# EAGLE design FidoBark (EAGLE 7.2.0)
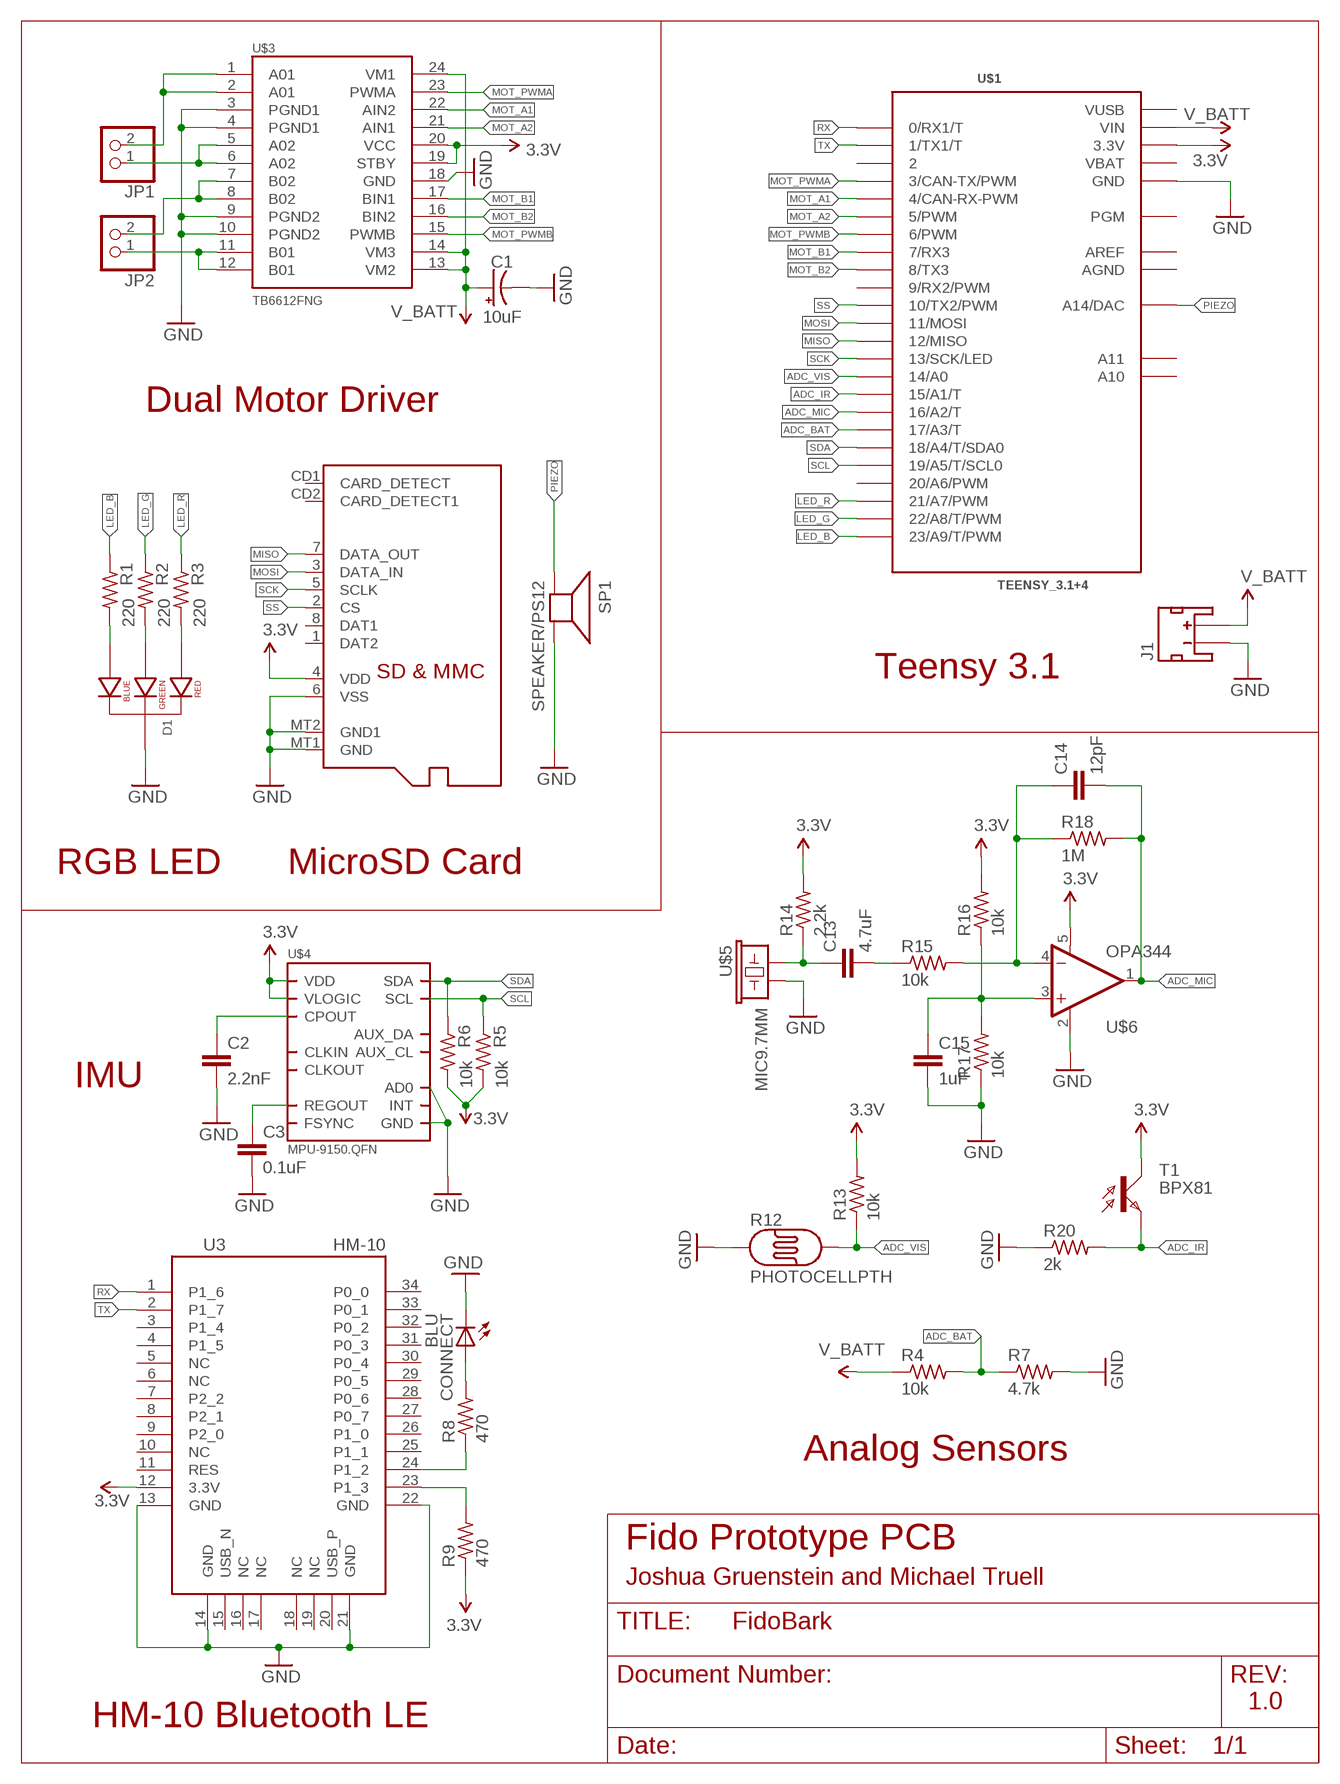
[diagram p0: schematic, sheet 1]

## Parts
C1  10uF  CAP_POL1206  [EIA3216]
C2  2.2nF  C-EUC0603  [C0603]
C3  0.1uF  C-EUC0603  [C0603]
C13  4.7uF  CAP0603-CAP  [0603-CAP]
C14  12pF  CAP0603-CAP  [0603-CAP]
C15  1uF  CAP0603-CAP  [0603-CAP]
CONNECT  BLU  LEDCHIPLED_0805  [CHIPLED_0805]
D1  LED-RGB-CC-THRUCLEAR  [LED-RGB-THRU]
J1  JST_2MM_MALE  [JST-2-SMD]
JP1  PINHD-1X2  [1X02]
JP2  PINHD-1X2  [1X02]
R1  220  R-US_R0603  [R0603]
R2  220  R-US_R0603  [R0603]
R3  220  R-US_R0603  [R0603]
R4  10k  R-US_R0603  [R0603]
R5  10k  R-US_R0603  [R0603]
R6  10k  R-US_R0603  [R0603]
R7  4.7k  R-US_R0603  [R0603]
R8  470  R-US_R0603  [R0603]
R9  470  R-US_R0603  [R0603]
R12  PHOTOCELLPTH  [PHOTOCELL]
R13  10k  R-US_R0603  [R0603]
R14  2.2k  R-US_R0603  [R0603]
R15  10k  R-US_R0603  [R0603]
R16  10k  R-US_R0603  [R0603]
R17  10k  R-US_R0603  [R0603]
R18  1M  R-US_R0603  [R0603]
R20  2k  R-US_R0603  [R0603]
SP1  SPEAKER/PS12  [PS12]
T1  BPX81  [BPX81]
U3  HM-10  [HM-10]
U$1  TEENSY_3.1+4  [TEENSY_3.1+4]
U$2  MICROSD  [MICROSD]
U$3  TB6612FNG  [SSOP24]
U$4  MPU-9150.QFN  [QFN.24.4X4]
U$5  MIC9.7MM  [MIC-9.7MM]
U$6  OPA344  [SOT23-5]

## Nets
3.3V: R5.2 R6.2 R9.1 R13.2 R14.2 R16.2 T1.C U3.12(3.3V) U$1.3.3V U$1.3.3V1(3.3V) U$2.4(VDD) U$3.19(STBY) U$3.20(VCC) U$4.3(VDD) U$4.8(VLOGIC) U$4.13(VDD) U$6.5(V+)
ADC_BAT: R4.2 R7.1 U$1.17/A3(17/A3/T)
ADC_IR: R20.2 T1.E U$1.15/A1(15/A1/T)
ADC_MIC: C14.2 R18.2 U$1.16/A2(16/A2/T) U$6.1(OUT)
ADC_VIS: R12.2 R13.1 U$1.14/A0
GND: C1.C(-) C2.2 C3.2 C15.2 CONNECT.C D1.2(CATHODE) J1.1(-) R7.2 R12.1 R17.1 R20.1 SP1.P$2(-) U3.13(GND) U3.14(GND) U3.21(GND) U3.22(GND) U$1.GND U$1.GND1(GND) U$2.6(VSS) U$2.MT1(GND) U$2.MT2(GND1) U$3.3(PGND1) U$3.4(PGND1) U$3.9(PGND2) U$3.10(PGND2) U$3.18(GND) U$4.9(AD0) U$4.15(GND) U$4.17(GND) U$4.18(GND) U$5.2 U$6.2(V-)
LED_B: R1.1 U$1.23/A9(23/A9/T/PWM)
LED_G: R2.1 U$1.22/A8(22/A8/T/PWM)
LED_R: R3.1 U$1.21/A7(21/A7/PWM)
MISO: U$1.12(12/MISO) U$2.7(DATA_OUT)
MOSI: U$1.11(11/MOSI) U$2.3(DATA_IN)
MOT_A1: U$1.4(4/CAN-RX-PWM) U$3.22(AIN2)
MOT_A2: U$1.5(5/PWM) U$3.21(AIN1)
MOT_B1: U$1.7(7/RX3) U$3.17(BIN1)
MOT_B2: U$1.8(8/TX3) U$3.16(BIN2)
MOT_PWMA: U$1.3(3/CAN-TX/PWM) U$3.23(PWMA)
MOT_PWMB: U$1.6(6/PWM) U$3.15(PWMB)
N$1: JP1.2 U$3.1(A01) U$3.2(A01)
N$2: D1.4(BLUE_CATHODE) R1.2
N$3: JP1.1 U$3.5(A02) U$3.6(A02)
N$4: JP2.2 U$3.7(B02) U$3.8(B02)
N$5: JP2.1 U$3.11(B01) U$3.12(B01)
N$6: D1.3(GREEN_CATHODE) R2.2
N$7: D1.1(RED_CATHODE) R3.2
N$8: C3.1 U$4.10(REGOUT)
N$9: C2.1 U$4.20(CPOUT)
N$10: R8.1 U3.24(P1_2)
N$11: R9.2 U3.23(P1_3)
N$16: CONNECT.A R8.2
N$28: C13.1 R14.1 U$5.1
N$29: C13.2 R15.1
N$30: C14.1 R15.2 R18.1 U$6.4(-IN)
N$32: C15.1 R16.1 R17.2 U$6.3(+IN)
PIEZO: SP1.P$1(+) U$1.A14(A14/DAC)
RX: U3.1(P1_6) U$1.0(0/RX1/T)
SCK: U$1.13(13/SCK/LED) U$2.5(SCLK)
SCL: R5.1 U$1.19/A5(19/A5/T/SCL0) U$4.23(SCL)
SDA: R6.1 U$1.18/A4(18/A4/T/SDA0) U$4.24(SDA)
SS: U$1.10(10/TX2/PWM) U$2.2(CS)
TX: U3.2(P1_7) U$1.1(1/TX1/T)
V_BATT: C1.A(+) J1.2(+) R4.1 U$1.VIN U$3.13(VM2) U$3.14(VM3) U$3.24(VM1)
Unconnected: J1.NC1(PAD1) J1.NC2(PAD2) U3.3(P1_4) U3.4(P1_5) U3.5(NC) U3.6(NC) U3.7(P2_2) U3.8(P2_1) U3.9(P2_0) U3.10(NC) U3.11(RES) U3.15(USB_N) U3.16(NC) U3.17(NC) U3.18(NC) U3.19(NC) U3.20(USB_P) U3.25(P1_1) U3.26(P1_0) U3.27(P0_7) U3.28(P0_6) U3.29(P0_5) U3.30(P0_4) U3.31(P0_3) U3.32(P0_2) U3.33(P0_1) U3.34(P0_0) U$1.2 U$1.9(9/RX2/PWM) U$1.20/A6(20/A6/PWM) U$1.A10 U$1.A11 U$1.PGM U$2.1(DAT2) U$2.8(DAT1) U$2.CD1(CARD_DETECT) U$2.CD2(CARD_DETECT1) U$4.1(CLKIN) U$4.6(AUX_DA) U$4.7(AUX_CL) U$4.11(FSYNC) U$4.12(INT) U$4.22(CLKOUT)

## Notes on the sheet
- Dual Motor Driver
- Teensy 3.1
- RGB LED | MicroSD Card
- IMU
- Analog Sensors
- Fido Prototype PCB
- Joshua Gruenstein and Michael Truell
- 1.0
- HM-10 Bluetooth LE

## Power pins joined to a net without a drawn wire
AGND: U$1.AGND
AREF: U$1.AREF
VBAT: U$1.VBAT
VUSB: U$1.VUSB

## Library data of the parts
C1 = SparkFun-Capacitors:CAP_POL: Capacitor Polarized These are standard SMD and PTH capacitors. Normally 10uF, 47uF, and 100uF in electrolytic and tantalum varieties. Always verify the external diameter of the through hole cap, it varies with capacity, voltage, and manufacturer. The EIA devices should be standard.
C2 C3 = rcl:C-EU: CAPACITOR, European symbol
C13-C15 = SparkFun-Passives:CAP: Capacitor Standard 0603 ceramic capacitor, and 0.1" leaded capacitor.
CONNECT = adafruit:LED: LED OSRAM: - CHIPLED LG R971, LG N971, LY N971, LG Q971, LY Q971, LO R971, LY R971 LH N974, LH R974 LS Q976, LO Q976, LY Q976 LO Q996 - Hyper CHIPLED LW Q18S LB Q993, LB Q99A, LB R99A - SideLED LS A670, LO A670, LY A670, LG A670, LP A670 LB A673, LV A673, LT A673, LW A673 LH A674 LY A675 LS A676, LA A676, LO A676, LY A676, LW A676 LS A679, LY A679, LG A679 - Hyper Micro SIDELED® LS Y876, LA Y876, LO Y876, LY Y876 LT Y87S - SmartLED LW L88C, LW L88S LB L89C, LB L89S, LG L890 LS L89K, LO L89K, LY L89K LS L896, LA L896, LO L896, LY L896 - TOPLED LS T670, LO T670, LY T670, LG T670, LP T670 LSG T670, LSP T670, LSY T670, LOP T670, LYG T670 LG T671, LOG T671, LSG T671 LB T673, LV T673, LT T673, LW T673 LH T674 LS T676, LA T676, LO T676, LY T676, LB T676, LH T676, LSB T676, LW T676 LB T67C, LV T67C, LT T67C, LS T67K, LO T67K, LY T67K, LW E67C LS E67B, LA E67B, LO E67B, LY E67B, LB E67C, LV E67C, LT E67C LW T67C LS T679, LY T679, LG T679 LS T770, LO T770, LY T770, LG T770, LP T770 LB T773, LV T773, LT T773, LW T773 LH T774 LS E675, LA E675, LY E675, LS T675 LS T776, LA T776, LO T776, LY T776, LB T776 LHGB T686 LT T68C, LB T68C - Hyper Mini TOPLED® LB M676 - Mini TOPLED Santana® LG M470 LS M47K, LO M47K, LY M47K Source: http://www.osram.convergy.de/
D1 = SparkFun-LED:LED-RGB-CC-THRU: RGB Through-hole common cathode LED SparkFun Storefront: COM-00105 (Clear) COM-09264 (Diffuse); PROD_ID: DIO-08418
J1 = SparkFun-Connectors:JST_2MM_MALE: Mates to single-cell LiPo batteries. CONN-11443 Now with smashable polarity marks!; BTM_NEG: -; BTM_POS: +; PROD_ID: CONN-11443; TOP_NEG: -; TOP_POS: +
JP1 JP2 = pinhead:PINHD-1X2: PIN HEADER
R1-R7 = rcl:R-US_: RESISTOR, American symbol
R8 R9 R13-R18 R20 = adafruit:R-US_: RESISTOR, American symbol
R12 = SparkFun-Sensors:PHOTOCELL: CdS photoresistor. This is a low cost way to detect light levels. Resistance decreases with more incoming light. SparkFun SKU: SEN-09088
SP1 = adafruit:SPEAKER: SPEAKER Source: Buerklin Added PS12 (for part # PS1240 piezo) http://www.ladyada.net/library/pcb/eaglelibrary.html
T1 = opto-trans-siemens:BPX81: PHOTO TRANSISTOR; OC_FARNELL: unknown; OC_NEWARK: unknown
U3 = HM-10_BLE:HM-10
U$1 = Teensy_3_Series_Board_v1.0:TEENSY_3.1+4: Footprint for Teensy 3.1 board using all through-holes, i.e. the entire perimeter plus the 4 through-holes inboard (A10,A11,AREF, VUSB)
U$2 = adafruit:MICROSD: Micro-SD / Transflash card holder with SPI pinout For the 3M # 2908-05WB-MG and/or 4UCON #19656 push-push type
U$3 = SparkFun-PowerIC:TB6612FNG: Toshiba 1A dual motor driver IC-09363; PROD_ID: IC-09363
U$4 = invensense:MPU-9150
U$5 = SparkFun-Sensors:MIC: Omni-directional electret microphone. 9.7mm standard diameter.; PROD_ID: COMP-08856
U$6 = SparkFun-AnalogIC:OPA344: Single gate rail-to-rail output op-amp. Inputs extend 300mV past rails.

## Board
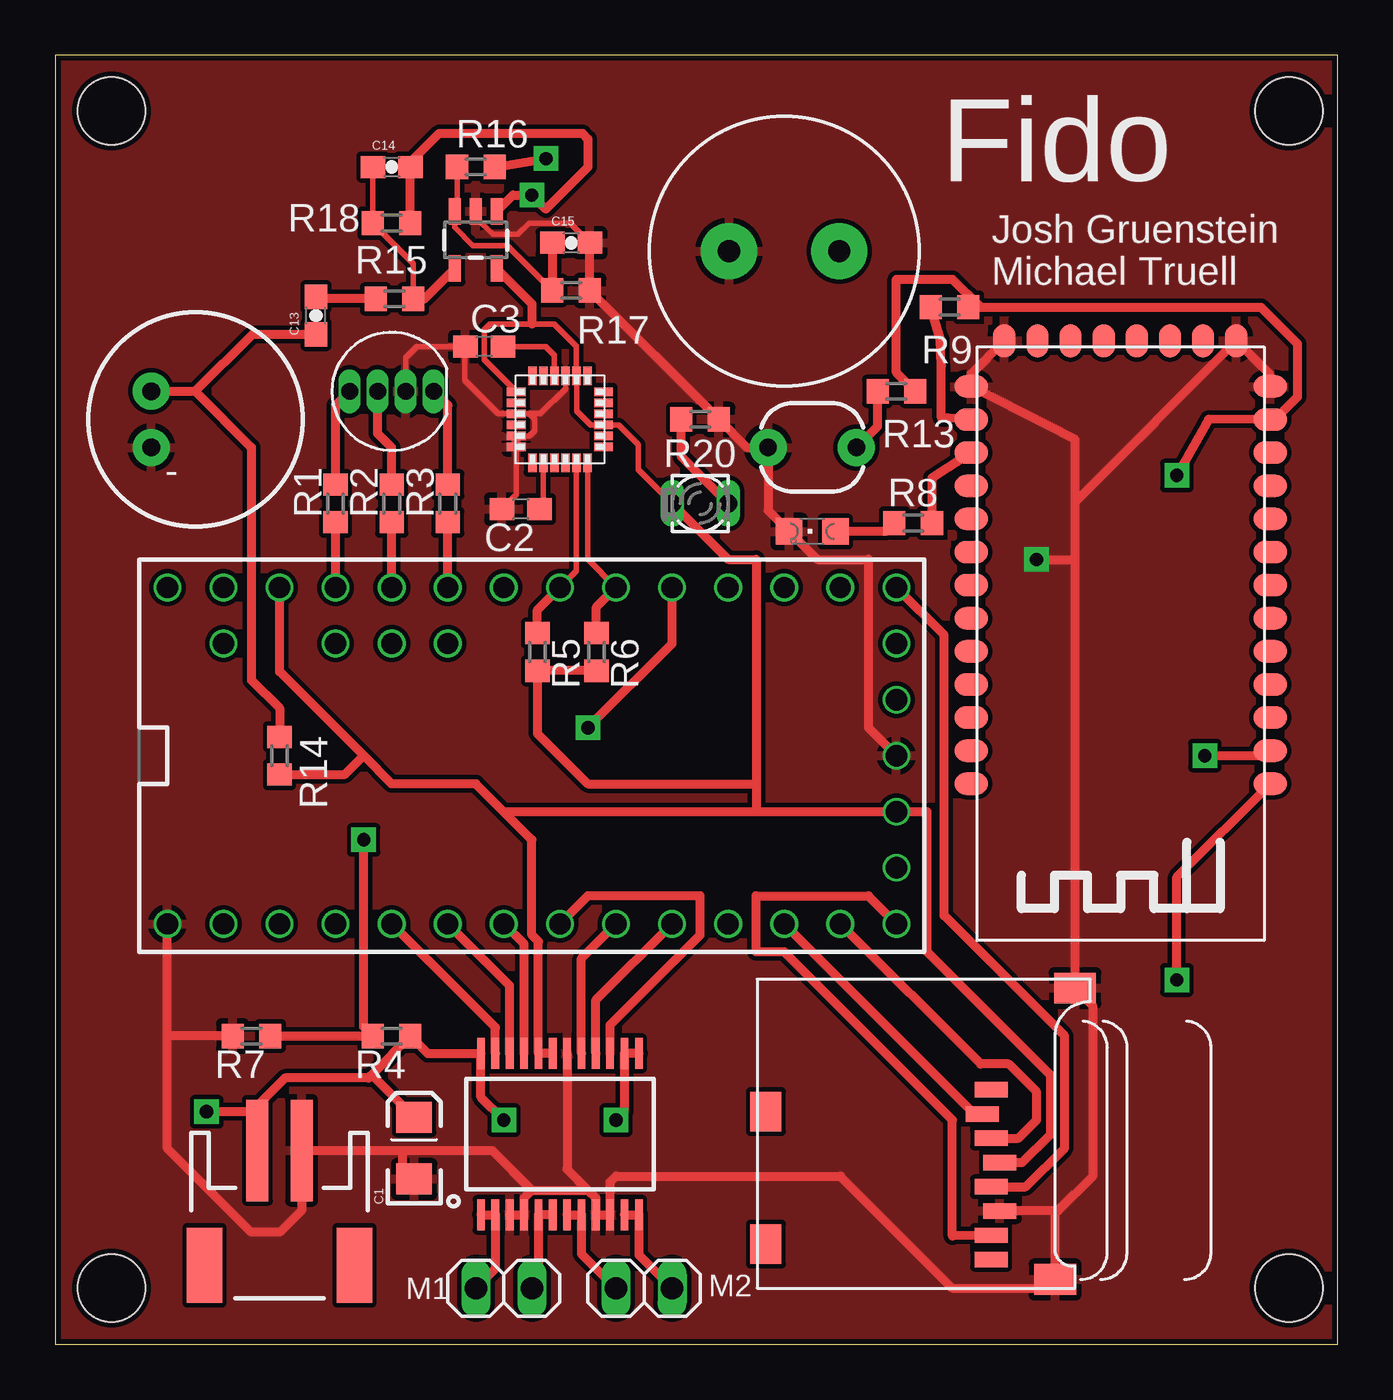
[diagram p1: board, top side]
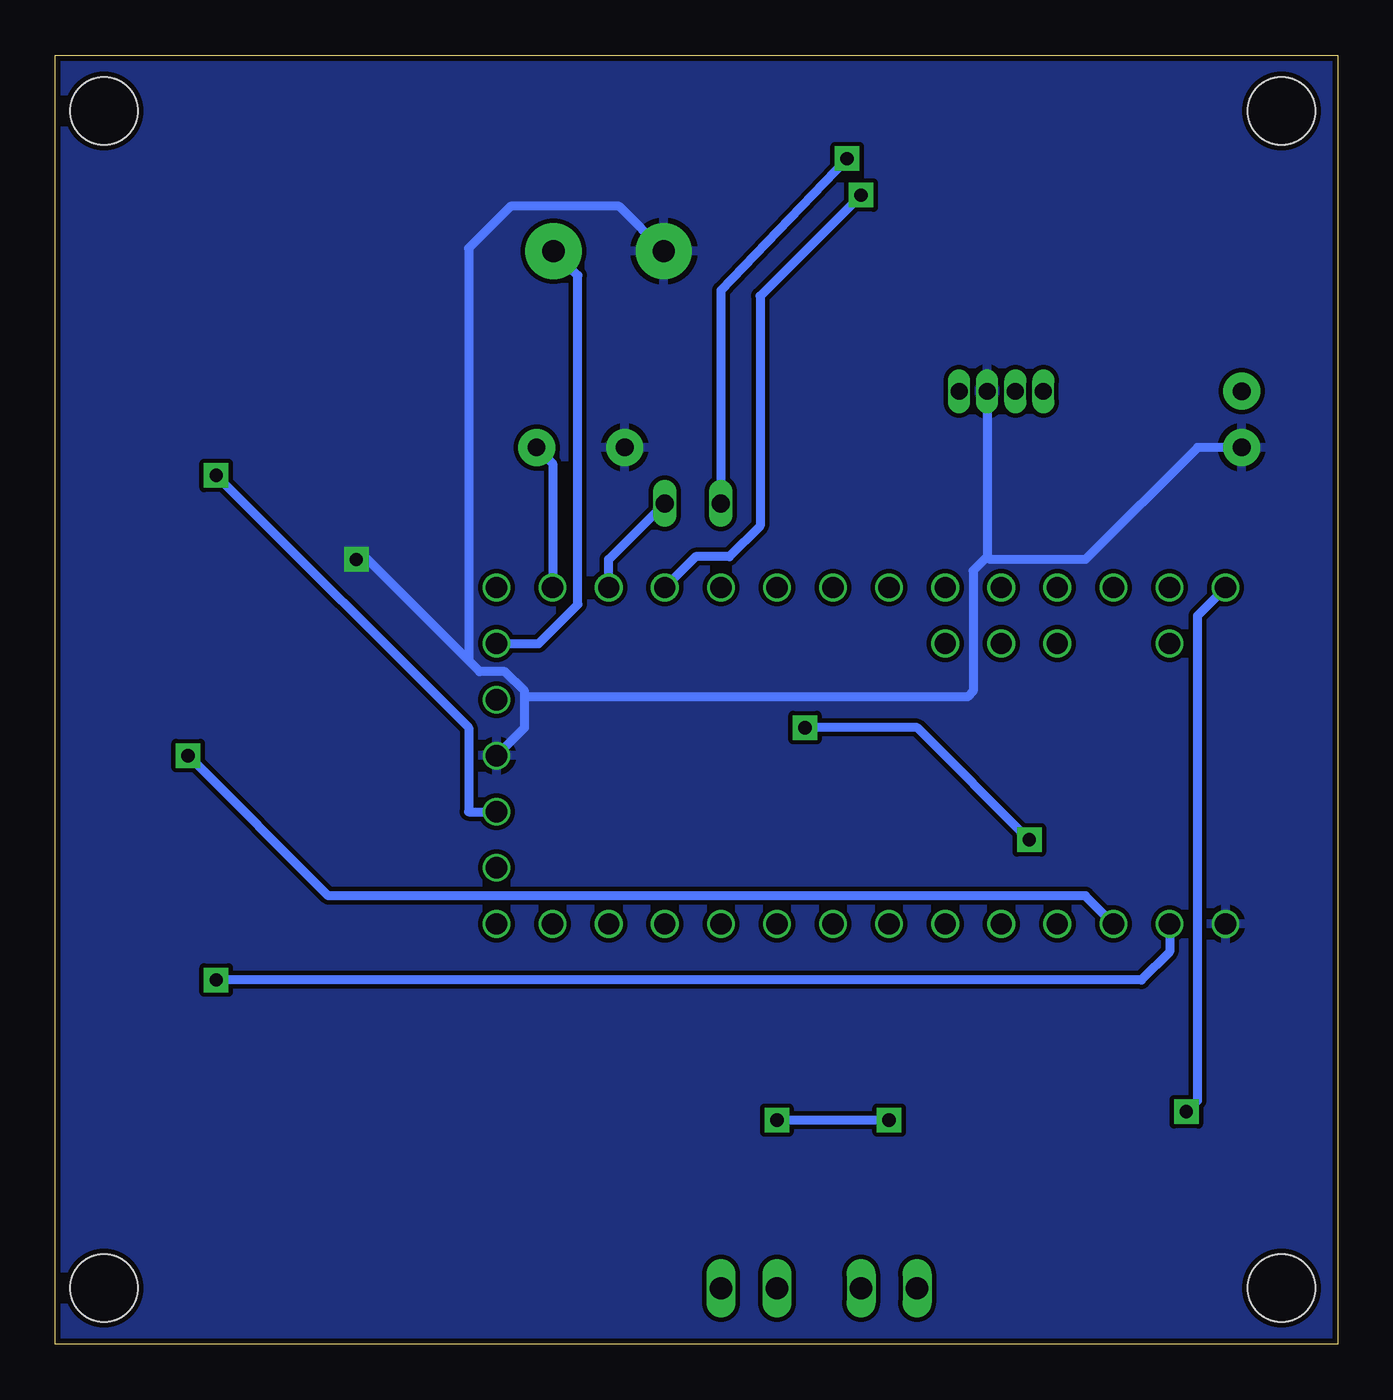
[diagram p2: board, bottom side, seen from below]

Size 58.09 x 58.41 mm. Coordinates in mm from the lower left corner, seen from the top.
Outline: 0,0 58.09,0 58.09,58.41 0,58.41 0,0
Copper layers (1*16): Top 0.035mm / dielectric 1.5mm / Bottom 0.035mm
Design rules "SparkFun *": minimum track width 8mil, minimum drill 20mil, track to track 8mil, track to pad 8mil, pad to pad 8mil, via to via 8mil, smd to smd 8mil, copper to edge 10mil, drill to drill 8mil, minimum pad ring 0mil, minimum via ring 10mil, stop-mask expansion 4mil, vias tented up to drill 25mil, thermal gap 10mil
Holes 3.05 mm at 2.54,2.54 55.88,2.54 2.54,55.88 55.88,55.88

### Footprints (pad centres in the part's own frame; a part is rotated, then mirrored left to right if it is on the bottom)
EIA3216 = smd 1.4 x 1.6: A 1.4,0; C -1.4,0
C0603 = smd 1.1 x 1: 1 -0.85,0; 2 0.85,0
0603-CAP = smd 1.1 x 1: 1 -0.85,0; 2 0.85,0
CHIPLED_0805 = smd 1.2 x 1.2: A 0,-1.05; C 0,1.05
LED-RGB-THRU = drill 0.762 pad 0.889 long: 1 1.905,0; 2 0.635,0; 3 -0.635,0; 4 -1.905,0
JST-2-SMD = smd 1 x 4.6: 1 -1,-3.7; 2 1,-3.7 | smd 1.6 x 3.4: NC1 -3.4,1.5; NC2 3.4,1.5
1X02 = drill 1.016 long: 1 -1.27,0; 2 1.27,0
R0603 = smd 1 x 1.1: 1 -0.85,0; 2 0.85,0
PHOTOCELL = drill 0.8 pad 1.676: 1 -2,0; 2 2,0
PS12 = drill 1 pad 2.54: P$1 -2.5,0; P$2 2.5,0
BPX81 = drill 0.813 long: C 1.27,0; E -1.27,0
HM-10 = smd 1.5 x 1: 1 -6.77,6.35; 2 -6.77,4.85; 3 -6.77,3.35; 4 -6.77,1.85; 5 -6.77,0.35; 6 -6.77,-1.15; 7 -6.77,-2.65; 8 -6.77,-4.15; 9 -6.77,-5.65; 10 -6.77,-7.15; 11 -6.77,-8.65; 12 -6.77,-10.15; 13 -6.77,-11.65; 22 6.77,-11.65; 23 6.77,-10.15; 24 6.77,-8.65; 25 6.77,-7.15; 26 6.77,-5.65; 27 6.77,-4.15; 28 6.77,-2.65; 29 6.77,-1.15; 30 6.77,0.35; 31 6.77,1.85; 32 6.77,3.35; 33 6.77,4.85; 34 6.77,6.35 | smd 1 x 1.5: 14 -5.23,-13.72; 15 -3.73,-13.72; 16 -2.23,-13.72; 17 -0.73,-13.72; 18 0.77,-13.72; 19 2.27,-13.72; 20 3.77,-13.72; 21 5.27,-13.72
TEENSY_3.1+4 = drill 0.965: 0 -7.62,15.24; 1 -7.62,12.7; 2 -7.62,10.16; 3 -7.62,7.62; 3.3V 7.62,12.7; 3.3V1 -2.54,-15.24; 4 -7.62,5.08; 5 -7.62,2.54; 6 -7.62,0; 7 -7.62,-2.54; 8 -7.62,-5.08; 9 -7.62,-7.62; 10 -7.62,-10.16; 11 -7.62,-12.7; 12 -7.62,-15.24; 13 7.62,-15.24; 14/A0 7.62,-12.7; 15/A1 7.62,-10.16; 16/A2 7.62,-7.62; 17/A3 7.62,-5.08; 18/A4 7.62,-2.54; 19/A5 7.62,0; 20/A6 7.62,2.54; 21/A7 7.62,5.08; 22/A8 7.62,7.62; 23/A9 7.62,10.16; A10 5.08,7.62; A11 5.08,5.08; A14 5.08,-15.24; AGND 7.62,15.24; AREF 5.08,10.16; GND -7.62,17.78; GND1 0,-15.24; PGM 2.54,-15.24; VBAT -5.08,-15.24; VIN 7.62,17.78; VUSB 5.08,15.24
MICROSD = smd 0.7 x 1.5: 1 9,-10.64; 2 7.9,-10.24; 3 6.8,-10.64; 4 5.7,-11.04; 5 4.6,-10.64; 6 3.5,-11.04; 7 2.4,-10.64; 8 1.3,-10.64 | smd 1.8 x 1.4: CD1 2,-0.44; CD2 8,-0.44 | smd 1.4 x 1.9: MT1 0.4,-13.54; MT2 13.6,-14.44
SSOP24 = smd 0.348 x 1.397: 1 -3.575,-3.656; 2 -2.925,-3.656; 3 -2.275,-3.656; 4 -1.625,-3.656; 5 -0.975,-3.656; 6 -0.325,-3.656; 7 0.325,-3.656; 8 0.975,-3.656; 9 1.625,-3.656; 10 2.275,-3.656; 11 2.925,-3.656; 12 3.575,-3.656; 13 3.575,3.656; 14 2.925,3.656; 15 2.275,3.656; 16 1.625,3.656; 17 0.975,3.656; 18 0.325,3.656; 19 -0.325,3.656; 20 -0.975,3.656; 21 -1.625,3.656; 22 -2.275,3.656; 23 -2.925,3.656; 24 -3.575,3.656
QFN.24.4X4 = smd 0.85 x 0.38: 1 -1.975,1.25; 2 -1.975,0.75; 3 -1.975,0.25; 4 -1.975,-0.25; 5 -1.975,-0.75; 6 -1.975,-1.25; 13 1.975,-1.25; 14 1.975,-0.75; 15 1.975,-0.25; 16 1.975,0.25; 17 1.975,0.75; 18 1.975,1.25 | smd 0.38 x 0.85: 7 -1.25,-1.975; 8 -0.75,-1.975; 9 -0.25,-1.975; 10 0.25,-1.975; 11 0.75,-1.975; 12 1.25,-1.975; 19 1.25,1.975; 20 0.75,1.975; 21 0.25,1.975; 22 -0.25,1.975; 23 -0.75,1.975; 24 -1.25,1.975
MIC-9.7MM = drill 0.8 pad 1.676: 1 -2,1.27; 2 -2,-1.27
SOT23-5 = smd 0.55 x 1.2: 1 -0.95,-1.3; 2 0,-1.3; 3 0.95,-1.3; 4 0.95,1.3; 5 -0.95,1.3

### Placement (x,y rotation side)
C1  16.26,8.89 90 top
C2  21.08,37.85 180 top
C3  19.43,45.21 180 top
C13  11.81,46.61 90 top
C14  15.24,53.34 0 top
C15  23.37,49.91 0 top
CONNECT  34.29,36.83 90 top
D1  15.24,43.18 0 top
J1  10.16,5.08 180 top
JP1  20.32,2.54 180 top
JP2  26.67,2.54 180 top
R1  12.7,38.1 90 top
R2  15.24,38.1 90 top
R3  17.78,38.1 90 top
R4  15.24,13.97 180 top
R5  21.84,31.37 270 top
R6  24.51,31.37 270 top
R7  8.89,13.97 180 top
R8  38.86,37.21 180 top
R9  40.51,46.99 180 top
R12  34.29,40.64 0 top
R13  38.1,43.18 0 top
R14  10.16,26.67 270 top
R15  15.37,47.37 0 top
R16  19.05,53.34 0 top
R17  23.37,47.75 180 top
R18  15.24,50.8 0 top
R20  29.21,41.91 180 top
SP1  33.02,49.53 180 top
T1  29.21,38.1 180 top
U3  48.26,31.75 180 top
U$1  22.86,26.67 90 top
U$2  31.75,2.54 90 top
U$3  22.86,9.53 0 top
U$4  22.86,41.91 180 top
U$5  6.35,41.91 0 top
U$6  19.05,50.04 180 top

### Tracks (layer width: path | path; a pad name or v marks a point on that pad's centre or on a via)
3.3V  (via drill 0.6)
  Top 0.254: T1.C 26.42,39.62 26.42,40.77 25.52,41.66 U$4.3 24.25,41.66 23.62,42.29 23.62,43.87 U$4.8 23.61,45.22 22.61,46.23 21.59,46.23 19.68,46.23 19.43,45.97 19.43,44.61 U$4.13
  Top 0.406: U$3.19 U$3.20 21.89,18.25 21.59,18.54 21.59,22.86 20.32,24.13 | 20.32,24.13 19.05,25.4 15.24,25.4 13.97,26.67 | 13.97,26.67 10.16,30.48 U$1.3.3V | 31.75,24.13 U$1.3.3V1 39.5,24.13 39.5,17.78 45.09,12.19 45.09,9.53 43.8,8.24 U$2.4 | 31.75,24.13 20.32,24.13 | v50.8,39.37 52.25,41.91 U3.12 55.23,41.9 56.26,42.93 56.26,45.34 54.61,46.99 41.91,46.99 | R9.1 41.91,46.99 | R13.2 38.1,44.03 38.1,48.26 40.64,48.26 41.91,46.99 | T1.C 30.48,35.56 31.75,35.56 31.75,25.4 | 31.75,25.4 31.75,24.13 | 31.75,25.4 24.13,25.4 21.84,27.69 R5.2 R6.2 | R14.2 13.12,25.82 13.97,26.67 | U$6.5 21.59,47.15 21.59,46.23 | R16.2 v22.23,53.72
  Bottom 0.406: v50.8,39.37 39.37,27.94 39.37,24.13 U$1.3.3V1 | v22.23,53.72 27.94,47.75 T1.C
ADC_BAT  (via drill 0.6)
  Top 0.406: R7.1 R4.2 13.97,14.39 v13.97,22.86 | v24.13,27.94 27.94,31.75 U$1.17/A3
  Bottom 0.406: v13.97,22.86 19.05,27.94 v24.13,27.94
ADC_IR
  Top 0.406: T1.E 28.36,40.22 R20.2
  Bottom 0.406: U$1.15/A1 33.02,35.56 T1.E
ADC_MIC  (via drill 0.6)
  Top 0.254: R18.2 C14.2
  Top 0.406: U$6.1 20.73,52.07 v21.59,52.07 22.23,51.44 24.13,53.34 24.13,54.61 23.88,54.86 17.4,54.86 16.09,53.55 R18.2
  Bottom 0.406: v21.59,52.07 26.16,47.5 26.16,37.08 27.56,35.69 29.08,35.69 U$1.16/A2
ADC_VIS
  Top 0.406: R12.2 37.25,41.6 R13.1
  Bottom 0.406: R12.2 35.56,39.91 U$1.14/A0
GND  (via drill 0.6)
  Top 0.254: C2.2 20.89,38.5 U$4.18 | U$4.17 21.48,41.16 21.72,41.4 21.72,41.91 21.46,42.16 U$4.15 | U$4.15 21.97,42.16 23.11,43.31 U$4.9 | U$4.15 20.07,42.16 18.54,43.69 18.54,45.17 C3.2 16.38,45.21 15.88,44.7 D1.2 | C15.2 23.33,50.8 21.46,50.8 20.95,50.29 19.81,50.29 19.05,51.05 U$6.2
  Top 0.406: U$3.3 U$3.4 21.23,6.63 21.59,6.99 | 21.59,6.99 24.13,6.99 | 24.13,6.99 24.48,6.63 U$3.9 U$3.10 25.14,7.36 25.4,7.62 35.56,7.62 40.64,2.54 44.89,2.54 U$2.MT1 45.29,5.92 45.41,6.04 | U$3.18 23.18,7.93 24.13,6.99 | 15.75,8.78 J1.1 11.16,6.08 10.16,5.08 8.89,5.08 5.08,8.89 5.08,13.97 | 15.75,8.78 19.8,8.78 21.59,6.99 | 5.08,13.97 U$1.GND | 45.41,6.04 46.99,7.62 46.99,15.34 U$2.MT2 46.19,35.56 | 45.41,6.04 U$2.6 | 46.19,35.56 46.19,38.17 | 46.19,38.17 46.19,40.99 U3.22 41.49,43.97 U3.21 | U3.13 55.03,43.93 U3.14 46.19,38.17 | v44.45,35.56 46.19,35.56 | U$1.GND1 36.83,27.94 36.83,35.56 34.51,35.56 CONNECT.C 32.29,37.78 R12.1 31.33,40.64 R20.1 R17.1 C15.2 | R7.2 5.08,13.97 | C1.C 15.75,8 15.75,8.78 | U$4.18 U$4.17
  Bottom 0.406: U$1.GND1 36.83,27.94 36.83,29.21 | 36.83,29.21 36.83,29.59 37.72,30.48 38.86,30.48 39.37,30.99 | 39.37,30.99 43.94,35.56 v44.45,35.56 | D1.2 15.88,35.69 | 15.88,35.69 16.51,35.05 16.51,29.59 16.76,29.34 36.7,29.34 36.83,29.21 | 39.37,30.99 39.37,49.66 37.47,51.56 32.55,51.56 SP1.P$2 | U$5.2 6.35,40.64 11.43,35.56 15.75,35.56 15.88,35.69
  pour Bottom: -3.81,-5.08 62.23,-5.08 62.23,60.96 -3.81,60.96
  pour Top: -1.27,59.69 59.69,59.69 59.69,-1.27 -1.27,-1.27
LED_B
  Top 0.406: U$1.23/A9 R1.1
LED_G
  Top 0.406: U$1.22/A8 R2.1
LED_R
  Top 0.406: U$1.21/A7 R3.1
MISO
  Top 0.406: U$2.7 40.64,4.91 40.64,10.16 33.02,17.78 31.75,17.78 31.75,20.32 36.83,20.32 U$1.12
MOSI
  Top 0.406: U$2.3 43.63,9.34 44.45,10.16 44.45,11.43 43.18,12.7 41.91,12.7 U$1.11
MOT_A1
  Top 0.406: U$3.22 20.59,16.25 U$1.4
MOT_A2
  Top 0.406: U$3.21 21.23,18.14 U$1.5
MOT_B1
  Top 0.406: U$3.17 23.84,17.48 U$1.7
MOT_B2
  Top 0.406: U$3.16 24.48,15.6 U$1.8
MOT_PWMA
  Top 0.406: U$3.23 19.93,14.36 U$1.3
MOT_PWMB
  Top 0.406: U$3.15 25.14,14.47 29.21,18.54 29.21,20.32 24.13,20.32 U$1.6
N$1
  Top 0.406: U$3.1 U$3.2 19.93,3.42 JP1.2
N$2
  Top 0.406: R1.2 12.7,42.55 D1.4
N$3
  Top 0.406: U$3.6 U$3.5 21.89,2.83 JP1.1
N$4
  Top 0.406: U$3.7 U$3.8 23.84,4.11 JP2.2
N$5
  Top 0.406: U$3.11 U$3.12 26.43,4.04 JP2.1
N$6
  Top 0.406: R2.2 15.24,40.64 14.61,41.27 D1.3
N$7
  Top 0.406: R3.2 17.78,42.55 D1.1
N$8
  Top 0.254: C3.1 22.23,45.21 22.61,44.83 U$4.10
N$9
  Top 0.254: C2.1 22.11,38.02 U$4.20
N$10
  Top 0.406: U3.24 39.71,39.26 R8.1
N$11
  Top 0.406: U3.23 40.13,41.99 40.13,44.32 40.09,45.55 R9.2
N$16
  Top 0.406: R8.2 37.63,36.83 CONNECT.A
N$28
  Top 0.406: U$5.1 6.35,43.18 | 6.35,43.18 8.89,40.64 8.89,30.1 10.16,28.83 R14.1 | C13.1 8.93,45.76 6.35,43.18
N$29
  Top 0.406: R15.1 11.9,47.37 C13.2
N$30
  Top 0.254: C14.1 R18.1 16.22,48.97 R15.2
  Top 0.406: U$6.4 16.73,47.37 R15.2
N$32
  Top 0.254: R17.2 20.49,49.78 18.92,49.78 18.1,50.61 U$6.3 18.2,51.44 R16.1
  Top 0.406: C15.1 R17.2
PIEZO
  Bottom 0.406: U$1.A14 36.2,31.75 34.42,33.53 34.42,48.43 SP1.P$1
RX  (via drill 0.6)
  Top 0.406: v50.8,16.51 50.8,21.17 U3.1
  Bottom 0.406: U$1.0 7.62,17.78 8.89,16.51 v50.8,16.51
SCK
  Top 0.406: U$2.5 43.97,7.14 45.72,8.89 45.72,13.97 40.26,19.43 40.26,32.13 U$1.13
SCL
  Top 0.254: U$1.19/A5 23.61,35.04 U$4.23
  Top 0.406: R5.1 21.84,33.27 U$1.19/A5
SDA
  Top 0.254: U$1.18/A4 24.11,35.58 U$4.24
  Top 0.406: R6.1 24.51,33.4 U$1.18/A4
SS
  Top 0.406: U$2.2 41.63,10.44 U$1.10
TX  (via drill 0.6)
  Top 0.406: v52.07,26.67 54.8,26.67 U3.2
  Bottom 0.406: U$1.1 11.43,20.32 45.72,20.32 v52.07,26.67
V_BATT  (via drill 0.6)
  Top 0.406: U$3.13 U$3.14 25.79,10.54 v25.4,10.16 | v20.32,10.16 19.29,11.2 U$3.24 16.88,13.18 R4.1 14.39,12.28 | 14.39,12.28 14.19,12.06 10.41,12.06 8.89,10.54 | 8.89,10.54 8.89,8.89 9,8.78 J1.2 | C1.A 14.39,12.15 14.39,12.28 | 8.89,10.54 v6.86,10.54
  Bottom 0.406: v25.4,10.16 v20.32,10.16 | v6.86,10.54 6.35,11.05 6.35,33.02 U$1.VIN

### Text on the board
tNames: Fido | Josh Gruenstein / Michael Truell | M1 | M2